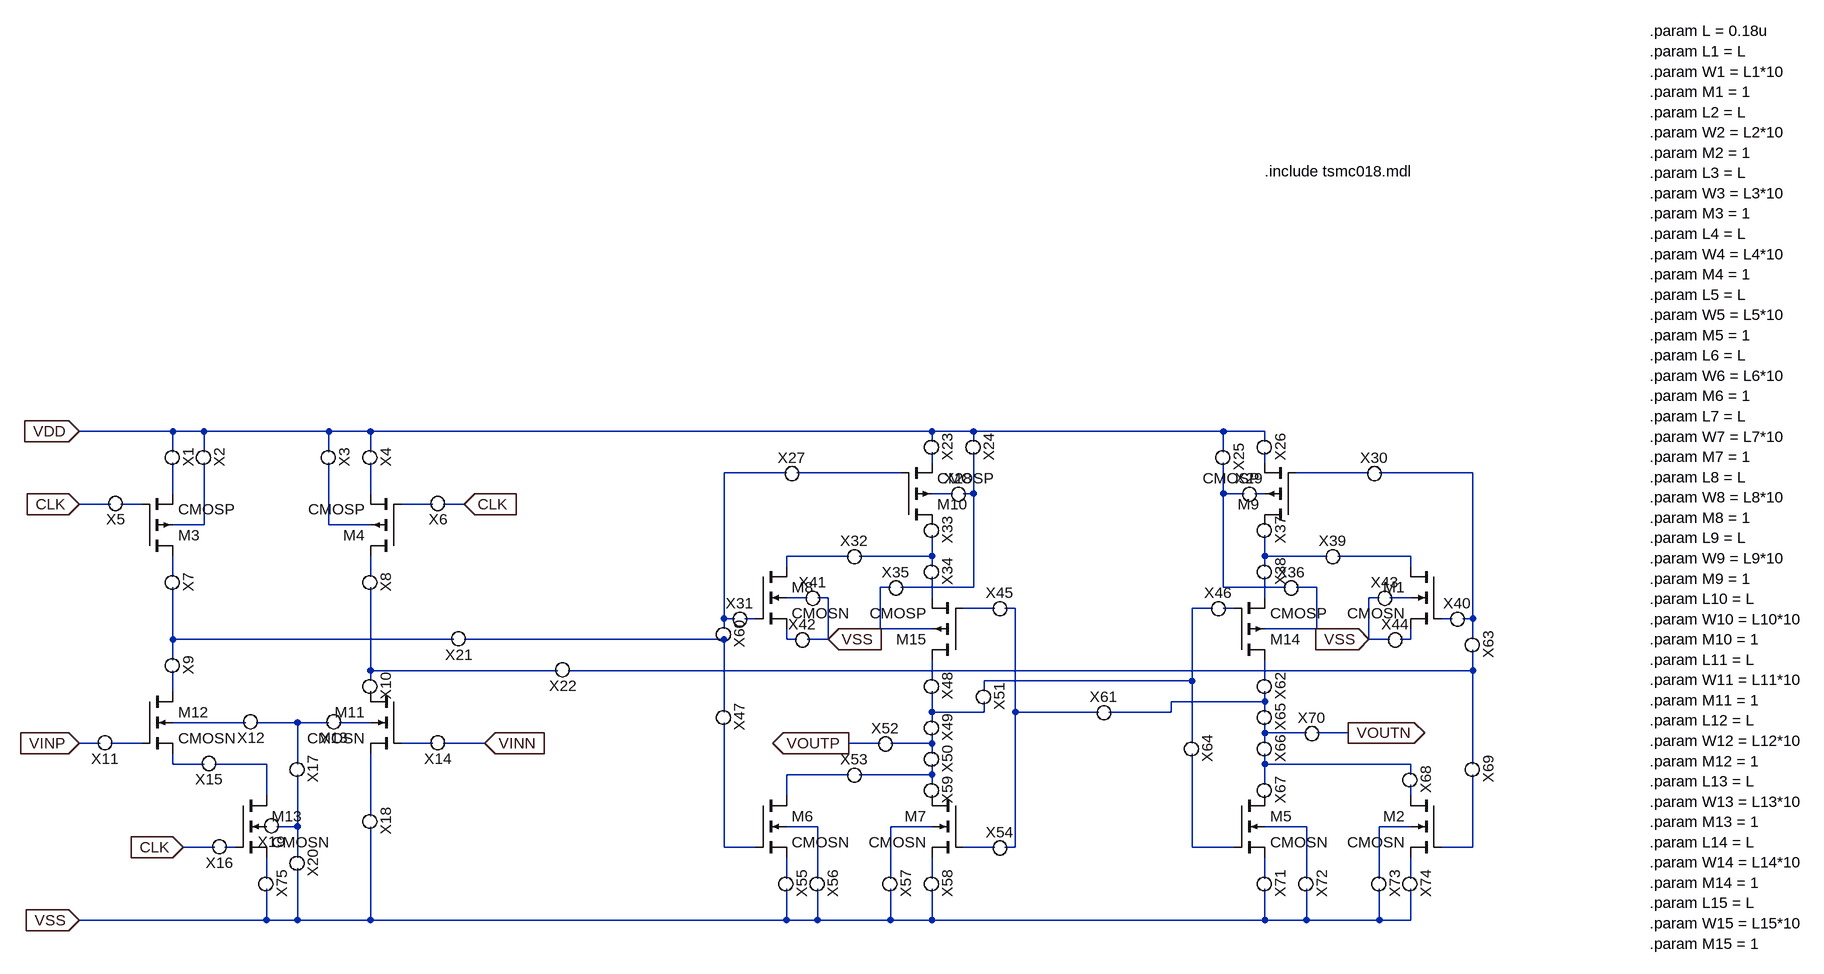
[diagram p0: schematic Draft6.asc]
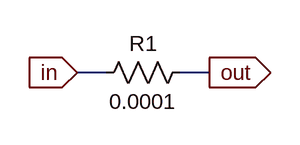
[diagram p1: sub-circuit para_register.asc]
Draft6.asc, the LTspice schematic file:
Version 4
SHEET 1 1544 1240
WIRE -1104 32 -1248 32
WIRE -1056 32 -1104 32
WIRE -864 32 -1056 32
WIRE -800 32 -864 32
WIRE 64 32 -800 32
WIRE 128 32 64 32
WIRE 512 32 128 32
WIRE 576 32 512 32
WIRE 64 48 64 32
WIRE 128 48 128 32
WIRE 576 48 576 32
WIRE -1104 64 -1104 32
WIRE -1056 64 -1056 32
WIRE -864 64 -864 32
WIRE -800 64 -800 32
WIRE 512 64 512 32
WIRE 64 80 64 64
WIRE 576 80 576 64
WIRE -160 96 -256 96
WIRE 16 96 -144 96
WIRE 736 96 624 96
WIRE 896 96 752 96
WIRE -1104 128 -1104 80
WIRE -800 128 -800 80
WIRE 96 128 64 128
WIRE 128 128 128 64
WIRE 128 128 112 128
WIRE 512 128 512 80
WIRE 544 128 512 128
WIRE 576 128 560 128
WIRE -1200 144 -1248 144
WIRE -1152 144 -1184 144
WIRE -704 144 -752 144
WIRE -656 144 -688 144
WIRE -1056 176 -1056 80
WIRE -1056 176 -1104 176
WIRE -864 176 -864 80
WIRE -800 176 -864 176
WIRE -64 224 -160 224
WIRE 64 224 64 192
WIRE 64 224 -48 224
WIRE 576 224 576 192
WIRE 672 224 576 224
WIRE 800 224 688 224
WIRE -160 240 -160 224
WIRE 64 240 64 224
WIRE 576 240 576 224
WIRE 800 240 800 224
WIRE -1104 256 -1104 224
WIRE -800 256 -800 224
WIRE 0 272 -16 272
WIRE 128 272 128 128
WIRE 128 272 16 272
WIRE 512 272 512 128
WIRE 608 272 512 272
WIRE 656 272 624 272
WIRE -128 288 -160 288
WIRE -96 288 -112 288
WIRE 64 288 64 256
WIRE 576 288 576 256
WIRE 752 288 736 288
WIRE 800 288 768 288
WIRE 160 304 112 304
WIRE 192 304 176 304
WIRE 496 304 464 304
WIRE 528 304 512 304
WIRE -256 320 -256 96
WIRE -240 320 -256 320
WIRE -208 320 -224 320
WIRE 864 320 848 320
WIRE 896 320 896 96
WIRE 896 320 880 320
WIRE -256 336 -256 320
WIRE -16 336 -16 272
WIRE 64 336 -16 336
WIRE 656 336 656 272
WIRE 656 336 576 336
WIRE -1104 352 -1104 272
WIRE -672 352 -1104 352
WIRE -256 352 -656 352
WIRE -160 352 -160 336
WIRE -144 352 -160 352
WIRE -96 352 -96 288
WIRE -96 352 -128 352
WIRE 736 352 736 288
WIRE 768 352 736 352
WIRE 800 352 800 336
WIRE 800 352 784 352
WIRE 896 352 896 320
WIRE -1104 384 -1104 352
WIRE -800 400 -800 272
WIRE -512 400 -800 400
WIRE 896 400 896 368
WIRE 896 400 -496 400
WIRE -800 416 -800 400
WIRE 64 416 64 384
WIRE 464 416 464 304
WIRE 464 416 144 416
WIRE 576 416 576 384
WIRE -1104 432 -1104 400
WIRE 144 432 144 416
WIRE 576 448 576 432
WIRE 576 448 432 448
WIRE -256 464 -256 352
WIRE 64 464 64 432
WIRE 144 464 144 448
WIRE 144 464 64 464
WIRE 192 464 192 304
WIRE 320 464 192 464
WIRE 432 464 432 448
WIRE 432 464 336 464
WIRE 576 464 576 448
WIRE -992 480 -1104 480
WIRE -912 480 -976 480
WIRE -864 480 -912 480
WIRE -800 480 -848 480
WIRE 64 480 64 464
WIRE 576 496 576 480
WIRE 640 496 576 496
WIRE 704 496 656 496
WIRE -1216 512 -1248 512
WIRE -1152 512 -1200 512
WIRE -704 512 -752 512
WIRE -624 512 -688 512
WIRE -16 512 -64 512
WIRE 64 512 64 496
WIRE 64 512 0 512
WIRE 464 512 464 416
WIRE 576 512 576 496
WIRE 64 528 64 512
WIRE -1104 544 -1104 528
WIRE -1056 544 -1104 544
WIRE -960 544 -1040 544
WIRE -912 544 -912 480
WIRE 576 544 576 528
WIRE 800 544 576 544
WIRE 896 544 896 400
WIRE -64 560 -160 560
WIRE 64 560 64 544
WIRE 64 560 -48 560
WIRE 800 560 800 544
WIRE 64 576 64 560
WIRE 576 576 576 544
WIRE -960 592 -960 544
WIRE -160 592 -160 560
WIRE 800 592 800 576
WIRE -800 624 -800 528
WIRE -912 640 -912 560
WIRE -912 640 -944 640
WIRE -112 640 -160 640
WIRE 64 640 0 640
WIRE 640 640 576 640
WIRE 800 640 752 640
WIRE -1040 672 -1088 672
WIRE -1008 672 -1024 672
WIRE -256 672 -256 480
WIRE -208 672 -256 672
WIRE 160 672 112 672
WIRE 192 672 192 464
WIRE 192 672 176 672
WIRE 464 672 464 528
WIRE 528 672 464 672
WIRE 896 672 896 560
WIRE 896 672 848 672
WIRE -912 688 -912 640
WIRE -960 720 -960 688
WIRE -160 720 -160 688
WIRE -112 720 -112 640
WIRE 0 720 0 640
WIRE 64 720 64 688
WIRE 576 720 576 688
WIRE 640 720 640 640
WIRE 752 720 752 640
WIRE 800 720 800 688
WIRE -960 784 -960 736
WIRE -960 784 -1248 784
WIRE -912 784 -912 704
WIRE -912 784 -960 784
WIRE -800 784 -800 640
WIRE -800 784 -912 784
WIRE -160 784 -160 736
WIRE -160 784 -800 784
WIRE -112 784 -112 736
WIRE -112 784 -160 784
WIRE 0 784 0 736
WIRE 0 784 -112 784
WIRE 64 784 64 736
WIRE 64 784 0 784
WIRE 576 784 576 736
WIRE 576 784 64 784
WIRE 640 784 640 736
WIRE 640 784 576 784
WIRE 752 784 752 736
WIRE 752 784 640 784
WIRE 800 784 800 736
WIRE 800 784 752 784
FLAG -1248 32 VDD
IOPIN -1248 32 In
FLAG -1248 144 CLK
IOPIN -1248 144 In
FLAG -1248 512 VINP
IOPIN -1248 512 In
FLAG -1248 784 VSS
IOPIN -1248 784 In
FLAG -624 512 VINN
IOPIN -624 512 In
FLAG -1088 672 CLK
IOPIN -1088 672 In
FLAG -656 144 CLK
IOPIN -656 144 In
FLAG -96 352 VSS
IOPIN -96 352 In
FLAG -64 512 VOUTP
IOPIN -64 512 Out
FLAG 736 352 VSS
IOPIN 736 352 In
FLAG 704 496 VOUTN
IOPIN 704 496 Out
SYMBOL pmos4 -1152 224 M180
SYMATTR InstName M3
SYMATTR Value CMOSP
SYMATTR Value2 l=0.18u w=1.8u m=1
SYMBOL nmos4 -208 240 R0
SYMATTR InstName M8
SYMATTR Value CMOSN
SYMATTR Value2 l=0.18u w=1.8u m=1
SYMBOL pmos4 -752 224 R180
SYMATTR InstName M4
SYMATTR Value CMOSP
SYMATTR Value2 l=0.18u w=1.8u m=1
SYMBOL pmos4 624 176 R180
SYMATTR InstName M9
SYMATTR Value CMOSP
SYMATTR Value2 l=0.18u w=1.8u m=1
SYMBOL pmos4 16 176 M180
SYMATTR InstName M10
SYMATTR Value CMOSP
SYMATTR Value2 l=0.18u w=1.8u m=1
SYMBOL pmos4 528 384 M180
SYMATTR InstName M14
SYMATTR Value CMOSP
SYMATTR Value2 l=0.18u w=1.8u m=1
SYMBOL pmos4 112 384 R180
SYMATTR InstName M15
SYMATTR Value CMOSP
SYMATTR Value2 l=0.18u w=1.8u m=1
SYMBOL nmos4 848 240 M0
SYMATTR InstName M1
SYMATTR Value CMOSN
SYMATTR Value2 l=0.18u w=1.8u m=1
SYMBOL nmos4 848 592 M0
SYMATTR InstName M2
SYMATTR Value CMOSN
SYMATTR Value2 l=0.18u w=1.8u m=1
SYMBOL nmos4 528 592 R0
SYMATTR InstName M5
SYMATTR Value CMOSN
SYMATTR Value2 l=0.18u w=1.8u m=1
SYMBOL nmos4 -208 592 R0
SYMATTR InstName M6
SYMATTR Value CMOSN
SYMATTR Value2 l=0.18u w=1.8u m=1
SYMBOL nmos4 112 592 M0
SYMATTR InstName M7
SYMATTR Value CMOSN
SYMATTR Value2 l=0.18u w=1.8u m=1
SYMBOL nmos4 -752 432 M0
SYMATTR InstName M11
SYMATTR Value CMOSN
SYMATTR Value2 l=0.18u w=1.8u m=1
SYMBOL nmos4 -1152 432 R0
SYMATTR InstName M12
SYMATTR Value CMOSN
SYMATTR Value2 l=0.18u w=1.8u m=1
SYMBOL nmos4 -1008 592 R0
SYMATTR InstName M13
SYMATTR Value CMOSN
SYMATTR Value2 l=0.18u w=1.8u m=1
SYMBOL para_register -1120 64 R90
SYMATTR InstName X1
SYMBOL para_register -1072 64 R90
SYMATTR InstName X2
SYMBOL para_register -880 64 R90
SYMATTR InstName X3
SYMBOL para_register -816 64 R90
SYMATTR InstName X4
SYMBOL para_register -1184 128 R180
SYMATTR InstName X5
SYMBOL para_register -688 128 R180
SYMATTR InstName X6
SYMBOL para_register -1120 256 R90
SYMATTR InstName X7
SYMBOL para_register -816 256 R90
SYMATTR InstName X8
SYMBOL para_register -1120 384 R90
SYMATTR InstName X9
SYMBOL para_register -816 416 R90
SYMATTR InstName X10
SYMBOL para_register -1200 496 R180
SYMATTR InstName X11
SYMBOL para_register -976 464 R180
SYMATTR InstName X12
SYMBOL para_register -848 464 R180
SYMATTR InstName X13
SYMBOL para_register -688 496 R180
SYMATTR InstName X14
SYMBOL para_register -1040 528 R180
SYMATTR InstName X15
SYMBOL para_register -1024 656 R180
SYMATTR InstName X16
SYMBOL para_register -928 544 R90
SYMATTR InstName X17
SYMBOL para_register -816 624 R90
SYMATTR InstName X18
SYMBOL para_register -944 624 R180
SYMATTR InstName X19
SYMBOL para_register -928 688 R90
SYMATTR InstName X20
SYMBOL para_register -656 336 R180
SYMATTR InstName X21
SYMBOL para_register -496 384 R180
SYMATTR InstName X22
SYMBOL para_register 48 48 R90
SYMATTR InstName X23
SYMBOL para_register 112 48 R90
SYMATTR InstName X24
SYMBOL para_register 496 64 R90
SYMATTR InstName X25
SYMBOL para_register 560 48 R90
SYMATTR InstName X26
SYMBOL para_register -160 112 R0
SYMATTR InstName X27
SYMBOL para_register 96 144 R0
SYMATTR InstName X28
SYMBOL para_register 544 144 R0
SYMATTR InstName X29
SYMBOL para_register 736 112 R0
SYMATTR InstName X30
SYMBOL para_register -240 336 R0
SYMATTR InstName X31
SYMBOL para_register -64 240 R0
SYMATTR InstName X32
SYMBOL para_register 48 176 R90
SYMATTR InstName X33
SYMBOL para_register 48 240 R90
SYMATTR InstName X34
SYMBOL para_register 0 288 R0
SYMATTR InstName X35
SYMBOL para_register 608 288 R0
SYMATTR InstName X36
SYMBOL para_register 560 176 R90
SYMATTR InstName X37
SYMBOL para_register 560 240 R90
SYMATTR InstName X38
SYMBOL para_register 672 240 R0
SYMATTR InstName X39
SYMBOL para_register 864 336 R0
SYMATTR InstName X40
SYMBOL para_register -128 304 R0
SYMATTR InstName X41
SYMBOL para_register -144 368 R0
SYMATTR InstName X42
SYMBOL para_register 752 304 R0
SYMATTR InstName X43
SYMBOL para_register 768 368 R0
SYMATTR InstName X44
SYMBOL para_register 160 320 R0
SYMATTR InstName X45
SYMBOL para_register 496 320 R0
SYMATTR InstName X46
SYMBOL para_register -272 464 R90
SYMATTR InstName X47
SYMBOL para_register 48 416 R90
SYMATTR InstName X48
SYMBOL para_register 48 480 R90
SYMATTR InstName X49
SYMBOL para_register 48 528 R90
SYMATTR InstName X50
SYMBOL para_register 128 432 R90
SYMATTR InstName X51
SYMBOL para_register -16 528 R0
SYMATTR InstName X52
SYMBOL para_register -64 576 R0
SYMATTR InstName X53
SYMBOL para_register 160 688 R0
SYMATTR InstName X54
SYMBOL para_register -176 720 R90
SYMATTR InstName X55
SYMBOL para_register -128 720 R90
SYMATTR InstName X56
SYMBOL para_register -16 720 R90
SYMATTR InstName X57
SYMBOL para_register 48 720 R90
SYMATTR InstName X58
SYMBOL para_register 48 576 R90
SYMATTR InstName X59
SYMBOL para_register -272 336 R90
SYMATTR InstName X60
SYMBOL para_register 320 480 R0
SYMATTR InstName X61
SYMBOL para_register 560 416 R90
SYMATTR InstName X62
SYMBOL para_register 880 352 R90
SYMATTR InstName X63
SYMBOL para_register 448 512 R90
SYMATTR InstName X64
SYMBOL para_register 560 464 R90
SYMATTR InstName X65
SYMBOL para_register 560 512 R90
SYMATTR InstName X66
SYMBOL para_register 560 576 R90
SYMATTR InstName X67
SYMBOL para_register 784 560 R90
SYMATTR InstName X68
SYMBOL para_register 880 544 R90
SYMATTR InstName X69
SYMBOL para_register 640 512 R0
SYMATTR InstName X70
SYMBOL para_register 560 720 R90
SYMATTR InstName X71
SYMBOL para_register 624 720 R90
SYMATTR InstName X72
SYMBOL para_register 736 720 R90
SYMATTR InstName X73
SYMBOL para_register 784 720 R90
SYMATTR InstName X74
SYMBOL para_register -976 720 R90
SYMATTR InstName X75
TEXT 1168 -584 Left 2 !.param L = 0.18u\n.param L1 = L\n.param W1 = L1*10\n.param M1 = 1\n.param L2 = L\n.param W2 = L2*10\n.param M2 = 1\n.param L3 = L\n.param W3 = L3*10\n.param M3 = 1\n.param L4 = L\n.param W4 = L4*10\n.param M4 = 1\n.param L5 = L\n.param W5 = L5*10\n.param M5 = 1\n.param L6 = L\n.param W6 = L6*10\n.param M6 = 1\n.param L7 = L\n.param W7 = L7*10\n.param M7 = 1\n.param L8 = L\n.param W8 = L8*10\n.param M8 = 1\n.param L9 = L\n.param W9 = L9*10\n.param M9 = 1\n.param L10 = L\n.param W10 = L10*10\n.param M10 = 1\n.param L11 = L\n.param W11 = L11*10\n.param M11 = 1\n.param L12 = L\n.param W12 = L12*10\n.param M12 = 1\n.param L13 = L\n.param W13 = L13*10\n.param M13 = 1\n.param L14 = L\n.param W14 = L14*10\n.param M14 = 1\n.param L15 = L\n.param W15 = L15*10\n.param M15 = 1
TEXT 576 -368 Left 2 !.include tsmc018.mdl

para_register.asc, the sub-circuit schematic file:
Version 4
SHEET 1 880 680
WIRE 160 -176 128 -176
WIRE 272 -176 240 -176
FLAG 128 -176 in
IOPIN 128 -176 In
FLAG 272 -176 out
IOPIN 272 -176 Out
SYMBOL res 256 -192 R90
WINDOW 0 0 56 VBottom 2
WINDOW 3 32 56 VTop 2
SYMATTR InstName R1
SYMATTR Value 0.0001

The netlist it stands for:
* Draft6.asc
M3 N021 N013 N007 N015 CMOSP l=0.18u w=1.8u m=1
M8 N017 N033 N037 N025 CMOSN l=0.18u w=1.8u m=1
M4 N022 N014 N008 N016 CMOSP l=0.18u w=1.8u m=1
M9 P001 N005 N002 N012 CMOSP l=0.18u w=1.8u m=1
M10 P002 N004 N001 N009 CMOSP l=0.18u w=1.8u m=1
M14 N042 N032 N027 N024 CMOSP l=0.18u w=1.8u m=1
M15 N041 N029 N026 N023 CMOSP l=0.18u w=1.8u m=1
M1 N020 N034 N038 N028 CMOSN l=0.18u w=1.8u m=1
M2 N058 N069 N074 N064 CMOSN l=0.18u w=1.8u m=1
M5 P003 N068 N073 N063 CMOSN l=0.18u w=1.8u m=1
M6 N056 N066 N071 N061 CMOSN l=0.18u w=1.8u m=1
M7 P004 N067 N072 N062 CMOSN l=0.18u w=1.8u m=1
M11 P005 N051 N059 N048 CMOSN l=0.18u w=1.8u m=1
M12 N043 N050 N053 N046 CMOSN l=0.18u w=1.8u m=1
M13 N054 N065 N070 P006 CMOSN l=0.18u w=1.8u m=1
XX1 VDD N007 para_register
XX2 VDD N015 para_register
XX3 VDD N016 para_register
XX4 VDD N008 para_register
XX5 N013 CLK para_register
XX6 CLK N014 para_register
XX7 N021 N035 para_register
XX8 N022 N039 para_register
XX9 N035 N043 para_register
XX10 N039 P005 para_register
XX11 N050 VINP para_register
XX12 N047 N046 para_register
XX13 N048 N047 para_register
XX14 VINN N051 para_register
XX15 N054 N053 para_register
XX16 N065 CLK para_register
XX17 N047 N060 para_register
XX18 N059 VSS para_register
XX19 N060 P006 para_register
XX20 N060 VSS para_register
XX21 N036 N035 para_register
XX22 N040 N039 para_register
XX23 VDD N001 para_register
XX24 VDD N010 para_register
XX25 VDD N011 para_register
XX26 VDD N002 para_register
XX27 N003 N004 para_register
XX28 N009 N010 para_register
XX29 N011 N012 para_register
XX30 N005 N006 para_register
XX31 N003 N033 para_register
XX32 N017 N018 para_register
XX33 P002 N018 para_register
XX34 N018 N026 para_register
XX35 N023 N010 para_register
XX36 N011 N024 para_register
XX37 P001 N019 para_register
XX38 N019 N027 para_register
XX39 N019 N020 para_register
XX40 N034 N006 para_register
XX41 N025 VSS para_register
XX42 N037 VSS para_register
XX43 VSS N028 para_register
XX44 VSS N038 para_register
XX45 N029 N030 para_register
XX46 N031 N032 para_register
XX47 N036 N066 para_register
XX48 N041 N045 para_register
XX49 N045 N052 para_register
XX50 N052 N057 para_register
XX51 N031 N045 para_register
XX52 VOUTP N052 para_register
XX53 N056 N057 para_register
XX54 N067 N030 para_register
XX55 N071 VSS para_register
XX56 N061 VSS para_register
XX57 N062 VSS para_register
XX58 N072 VSS para_register
XX59 N057 P004 para_register
XX60 N003 N036 para_register
XX61 N030 N044 para_register
XX62 N042 N044 para_register
XX63 N006 N040 para_register
XX64 N031 N068 para_register
XX65 N044 N049 para_register
XX66 N049 N055 para_register
XX67 N055 P003 para_register
XX68 N055 N058 para_register
XX69 N040 N069 para_register
XX70 N049 VOUTN para_register
XX71 N073 VSS para_register
XX72 N063 VSS para_register
XX73 N064 VSS para_register
XX74 N074 VSS para_register
XX75 N070 VSS para_register

* block symbol definitions
.subckt para_register in out
R1 out in 0.0001
.ends para_register

.model NMOS NMOS
.model PMOS PMOS
.lib standard.mos
.param L = 0.18u
.param L1 = L
.param W1 = L1*10
.param M1 = 1
.param L2 = L
.param W2 = L2*10
.param M2 = 1
.param L3 = L
.param W3 = L3*10
.param M3 = 1
.param L4 = L
.param W4 = L4*10
.param M4 = 1
.param L5 = L
.param W5 = L5*10
.param M5 = 1
.param L6 = L
.param W6 = L6*10
.param M6 = 1
.param L7 = L
.param W7 = L7*10
.param M7 = 1
.param L8 = L
.param W8 = L8*10
.param M8 = 1
.param L9 = L
.param W9 = L9*10
.param M9 = 1
.param L10 = L
.param W10 = L10*10
.param M10 = 1
.param L11 = L
.param W11 = L11*10
.param M11 = 1
.param L12 = L
.param W12 = L12*10
.param M12 = 1
.param L13 = L
.param W13 = L13*10
.param M13 = 1
.param L14 = L
.param W14 = L14*10
.param M14 = 1
.param L15 = L
.param W15 = L15*10
.param M15 = 1
.include tsmc018.mdl
.backanno
.end